# Altium schematic sheet Sheet.SchDoc
size 209 x 297 mm; Address1: Address1; Address2: Address2; Address3: Address3; Address4: Address4; DocumentNumber: АБВГ.123456.001 Э3; SheetNumber: 1; SheetTotal: 1; Scale: 1:1; DocumentType: Схема электрическая принципиальная; FirstReferrence: АБВГ.123456.001
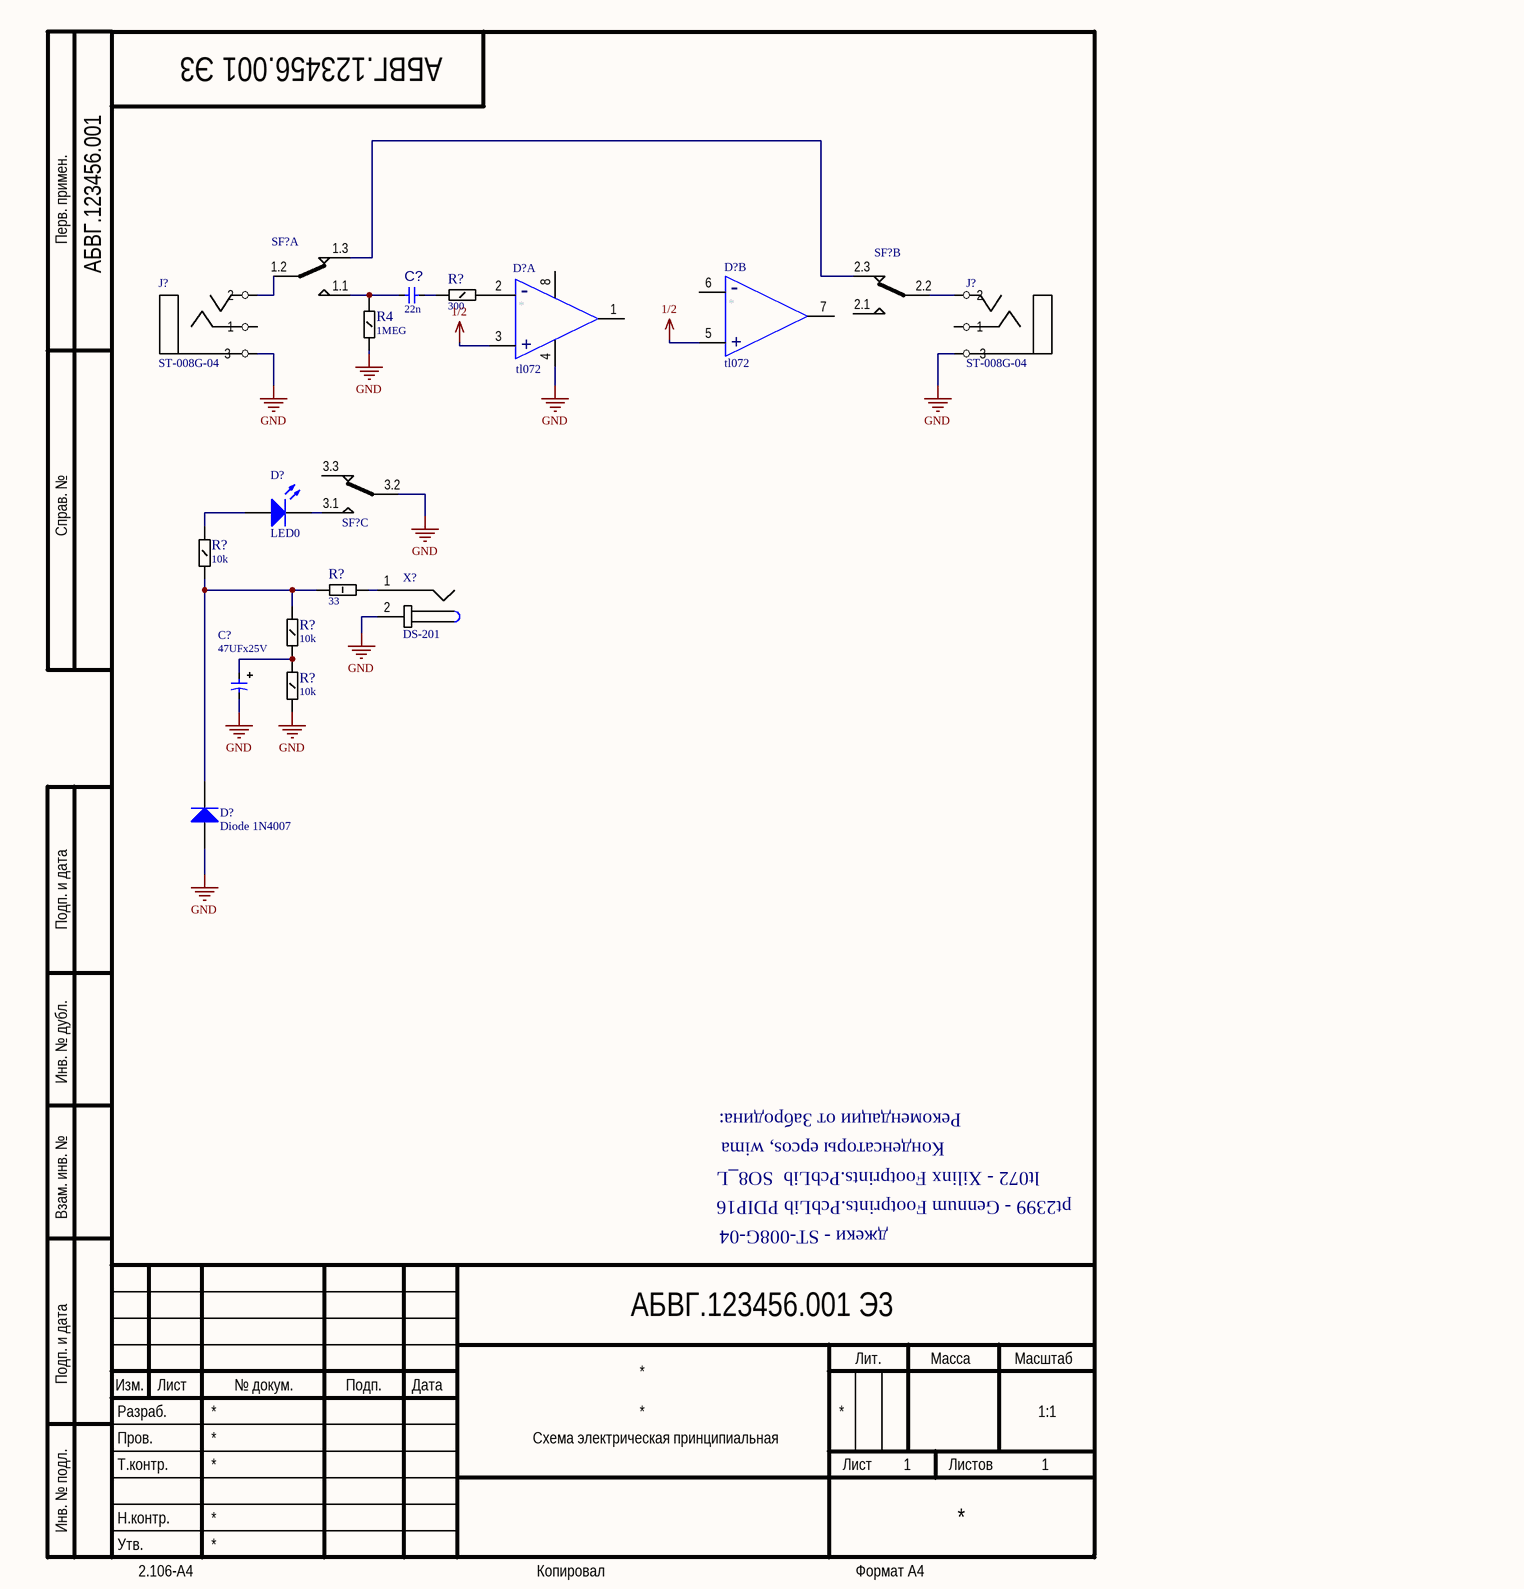
[diagram p0: Sheet.SchDoc]

## Parts
(Parts that share a designator on the sheet are numbered #1, #2 ... from top to bottom, then left to right.)
C?#1  value 22n  [B32529C 3222]  (hidden comment: C0603)
C?#2  value 47UFx25V  [B41828_d5]  (hidden comment: C15x8)
D?#1  tl072  [SO8_L]  (part B of 2)
D?#2  tl072  [SO8_L]  (part A of 2)
D?#3  LED0  [LED-0]
D?#4  Diode 1N4007  [DO-41]
J?#1  ST-008G-04  [ST-008G-04]
J?#2  ST-008G-04  [ST-008G-04]
R4  value 1MEG  [R1206]  (hidden comment: R1206-0,25 W)
R?#1  value 300  [R1206]  (hidden comment: R1206-0,25 W)
R?#2  value 10k  [R1206]  (hidden comment: R1206-0,25 W)
R?#3  value 33  [R2512]  (hidden comment: R2512-1 W)
R?#4  value 10k  [R1206]  (hidden comment: R1206-0,25 W)
R?#5  value 10k  [R1206]  (hidden comment: R1206-0,25 W)
SF?#1  SF-17020F-0302-21R-L  [SF-17020F-0302-21R-L]  (value not drawn)  (part A of 3)
SF?#2  SF-17020F-0302-21R-L  [SF-17020F-0302-21R-L]  (value not drawn)  (part B of 3)
SF?#3  SF-17020F-0302-21R-L  [SF-17020F-0302-21R-L]  (value not drawn)  (part C of 3)
X?  DS-201  [DS-201]

## Nets
1/2: D?#1.5 D?#2.3(Vp)
GND: C?#2.2 D?#2.4(Vn) D?#4.1(A) J?#1.3 J?#2.3 R4.1 R?#5.1 SF?#3.3.2 X?.2
NetC?#1_1: C?#1.1 R4.2 SF?#1.1.1
NetC?#1_2: C?#1.2 R?#1.1
NetC?#2_1: C?#2.1 R?#4.1 R?#5.2
NetD?#2_2: D?#2.2(GND) R?#1.2
NetD?#3_1: D?#3.1(A) R?#2.2
NetD?#3_2: D?#3.2(K) SF?#3.3.1
NetD?#4_2: D?#4.2(K) R?#2.1 R?#3.1 R?#4.2
NetJ?#1_2: J?#1.2 SF?#1.1.2
NetJ?#2_2: J?#2.2 SF?#2.2.2
NetR?#3_2: R?#3.2 X?.1
NetSF?#1_1.3: SF?#1.1.3 SF?#2.2.3

Not connected (* = marked no-connect by the designer): D?#1 6 7; D?#2 1(Q) 5(LE/HYS) 8; J?#1 1; J?#2 1; SF?#2 2.1; SF?#3 3.3(1.3)

## Notes on the sheet
- Конденсаторы epcos, wima
- Рекомендации от Забродина:
- lt072 - Xilinx Footprints.PcbLib  SO8_L
- pt2399 - Gennum Footprints.PcbLib PDIP16
- джеки - ST-008G-04
- Перв. примен.
- Справ. №
- Подп. и дата
- Инв. № дубл.
- Взам. инв. №
- Разраб.
- Изм.
- Лист
- № докум.
- Подп.
- Дата
- Лит.
- Масса
- Масштаб
- Пров.
- Т.контр.
- Листов
- Инв. № подл.
- Утв.
- Н.контр.
- 2.106-A4
- Копировал
- Формат А4
- (in symbol tl072, part A) -; +
- (in symbol tl072, part B) -; +

## Library data of the parts
C?#1 = Condensator C22n: ManufacturerPartNumber: B32529C1223J000; TitAD: Конденсатор; Part Number: Condensator C22n
C?#2 = Condensator b41851: Manufacturer: Epcos; TitAD: Конденсатор; Part Number: Condensator b41851
D?#3 = LED0: Typical INFRARED GaAs LED; Published: 8-Jun-2000; LatestRevisionDate: 08-Jul-2005; LatestRevisionNote: Mech Layer 1 removed.; PackageReference: LED-0; Publisher: Altium Limited; PackageDescription: LED; 2 Leads
D?#4 = Diode 1N4007: 1 Amp General Purpose Rectifier; Published: 8-Jun-2000; LatestRevisionDate: 17-Jul-2002; LatestRevisionNote: Re-released for DXP Platform.; DatasheetVersion: 1998; PackageVersion: Aug-1999; PackageReference: DO-41; Publisher: Altium Limited; PackageDescription: Diode, Axial; Body 5.2 x 2.7 mm (LxDia. max), Lead Dia. 0.86 mm (max); Code_JEDEC: DO-204-AL; ComponentLink1Description: Manufacturer Link; ComponentLink1URL: http://www.fairchildsemi.com/; ComponentLink2Description: Datasheet; ComponentLink2URL: http://www.fairchildsemi.com/ds/1N%2F1N4001.pdf
R4 R?#1 = Resistor 1206 300: TitAD: Резистор; Part Number: Resistor 1206 300; Корпус: R1206
R?#2 R?#4 R?#5 = Resistor 1206 1.5k: TitAD: Резистор; Part Number: Resistor 1206 1.5k; Корпус: R1206
R?#3 = Resistor 2506 33: TitAD: Резистор; Part Number: Resistor 2506 33; Корпус: R2512
SF?#1-SF?#3 = SF-17020F: TitAD: Разъем; Part Number: SF-17020F
X? = DS-201: TitAD: Разъем; Part Number: DS-201
D?#1 D?#2 = tl072: Part Number: tl072